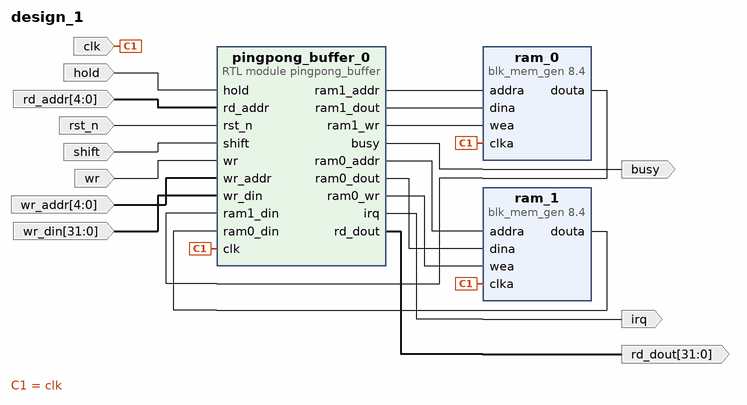
[diagram p0: block diagram of the top level]
# Vivado block design design_1, xczu3eg-sbva484-1-i, Vivado 2020.2
create_bd_design design_1

create_bd_port -dir O busy
create_bd_port -dir I -type clk clk
create_bd_port -dir I hold
create_bd_port -dir O -type intr irq
create_bd_port -dir I -from 4 -to 0 rd_addr
create_bd_port -dir O -from 31 -to 0 rd_dout
create_bd_port -dir I -type rst rst_n
create_bd_port -dir I shift
create_bd_port -dir I wr
create_bd_port -dir I -from 4 -to 0 wr_addr
create_bd_port -dir I -from 31 -to 0 wr_din

create_bd_cell -type module -reference pingpong_buffer pingpong_buffer_0
set_property -dict {CONFIG.addr_width 5 CONFIG.word_width 32} [get_bd_cells pingpong_buffer_0]
create_bd_cell -type ip -vlnv xilinx.com:ip:blk_mem_gen:8.4 ram_0
set_property -dict [list \
  CONFIG.Enable_32bit_Address false \
  CONFIG.Enable_A Always_Enabled \
  CONFIG.Fill_Remaining_Memory_Locations true \
  CONFIG.Register_PortA_Output_of_Memory_Primitives false \
  CONFIG.Use_Byte_Write_Enable false \
  CONFIG.Use_RSTA_Pin false \
  CONFIG.Write_Depth_A 32 \
  CONFIG.use_bram_block Stand_Alone \
] [get_bd_cells ram_0]
create_bd_cell -type ip -vlnv xilinx.com:ip:blk_mem_gen:8.4 ram_1
set_property -dict [list \
  CONFIG.Enable_32bit_Address false \
  CONFIG.Enable_A Always_Enabled \
  CONFIG.Fill_Remaining_Memory_Locations true \
  CONFIG.Register_PortA_Output_of_Memory_Primitives false \
  CONFIG.Use_Byte_Write_Enable false \
  CONFIG.Use_RSTA_Pin false \
  CONFIG.Write_Depth_A 32 \
  CONFIG.use_bram_block Stand_Alone \
] [get_bd_cells ram_1]

# ---- connections ----

connect_bd_net -net clk_0_1 [get_bd_ports clk] [get_bd_pins ram_0/clka] [get_bd_pins ram_1/clka] [get_bd_pins pingpong_buffer_0/clk]
connect_bd_net [get_bd_ports hold] [get_bd_pins pingpong_buffer_0/hold]
connect_bd_net [get_bd_pins pingpong_buffer_0/busy] [get_bd_ports busy]
connect_bd_net [get_bd_pins pingpong_buffer_0/irq] [get_bd_ports irq]
connect_bd_net [get_bd_pins pingpong_buffer_0/ram0_addr] [get_bd_pins ram_1/addra]
connect_bd_net [get_bd_pins pingpong_buffer_0/ram0_dout] [get_bd_pins ram_1/dina]
connect_bd_net [get_bd_pins pingpong_buffer_0/ram0_wr] [get_bd_pins ram_1/wea]
connect_bd_net [get_bd_pins pingpong_buffer_0/ram1_addr] [get_bd_pins ram_0/addra]
connect_bd_net [get_bd_pins pingpong_buffer_0/ram1_dout] [get_bd_pins ram_0/dina]
connect_bd_net [get_bd_pins pingpong_buffer_0/ram1_wr] [get_bd_pins ram_0/wea]
connect_bd_net [get_bd_pins pingpong_buffer_0/rd_dout] [get_bd_ports rd_dout]
connect_bd_net [get_bd_pins ram_0/douta] [get_bd_pins pingpong_buffer_0/ram1_din]
connect_bd_net [get_bd_pins ram_1/douta] [get_bd_pins pingpong_buffer_0/ram0_din]
connect_bd_net [get_bd_ports rd_addr] [get_bd_pins pingpong_buffer_0/rd_addr]
connect_bd_net [get_bd_ports rst_n] [get_bd_pins pingpong_buffer_0/rst_n]
connect_bd_net [get_bd_ports shift] [get_bd_pins pingpong_buffer_0/shift]
connect_bd_net [get_bd_ports wr] [get_bd_pins pingpong_buffer_0/wr]
connect_bd_net [get_bd_ports wr_addr] [get_bd_pins pingpong_buffer_0/wr_addr]
connect_bd_net [get_bd_ports wr_din] [get_bd_pins pingpong_buffer_0/wr_din]

validate_bd_design
save_bd_design
